# EAGLE schematic SWD (EAGLE 6.1)
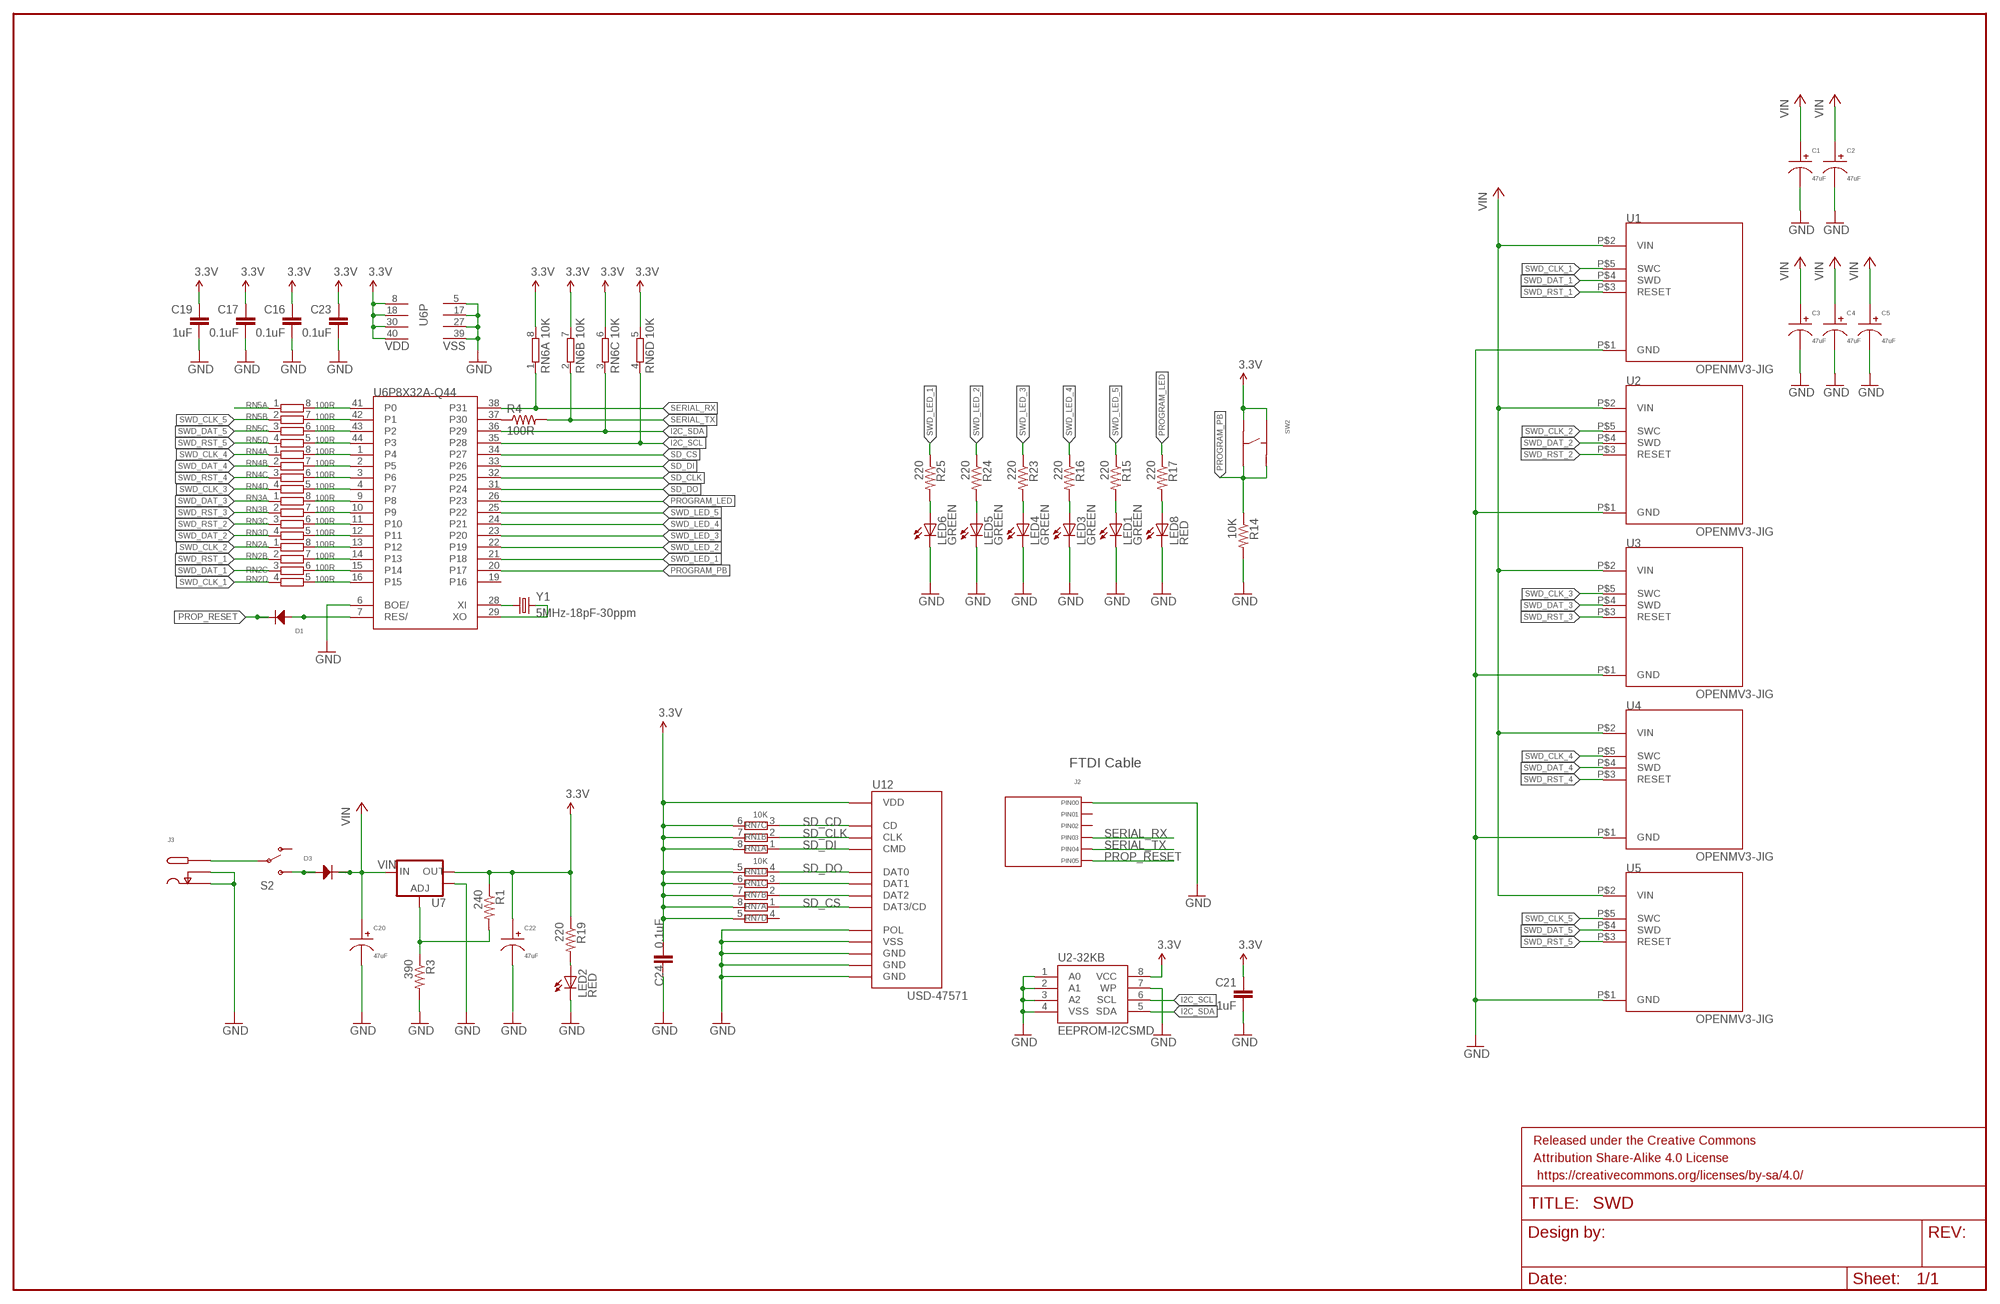
[diagram p0: schematic, sheet 1]

## Parts
C1  47uF  CAPACITOR_P_6.3MM  [CP6.3MM]
C2  47uF  CAPACITOR_P_6.3MM  [CP6.3MM]
C3  47uF  CAPACITOR_P_6.3MM  [CP6.3MM]
C4  47uF  CAPACITOR_P_6.3MM  [CP6.3MM]
C5  47uF  CAPACITOR_P_6.3MM  [CP6.3MM]
C16  0.1uF  CAP0603-CAP  [0603-CAP]
C17  0.1uF  CAP0603-CAP  [0603-CAP]
C19  1uF  CAP0603-CAP  [0603-CAP]
C20  47uF  CAPACITOR_P_6.3MM  [CP6.3MM]
C21  1uF  CAP0603-CAP  [0603-CAP]
C22  47uF  CAPACITOR_P_6.3MM  [CP6.3MM]
C23  0.1uF  CAP0603-CAP  [0603-CAP]
C24  0.1uF  CAP0603-CAP  [0603-CAP]
D1  DIODE_SOD-123  [SOD-123]
D3  DIODE_SMA  [SMA]
FRAME1  FRAME-LEDGER  [CREATIVE_COMMONS]
J2  HEADER_01X06_PTH_2.54MM  [PTH_2.54MM_01X06]
J3  DC_PWR_JACK_2.5MM_RIGHT  [DC_PWR_JACK]
LED1  GREEN  LED0603  [LED-0603]
LED2  RED  LED0603  [LED-0603]
LED3  GREEN  LED0603  [LED-0603]
LED4  GREEN  LED0603  [LED-0603]
LED5  GREEN  LED0603  [LED-0603]
LED6  GREEN  LED0603  [LED-0603]
LED8  RED  LED0603  [LED-0603]
R1  240  RESISTOR0603-RES  [0603-RES]
R3  390  RESISTOR0603-RES  [0603-RES]
R4  100R  RESISTOR0603-RES  [0603-RES]
R14  10K  RESISTOR0603-RES  [0603-RES]
R15  220  RESISTOR0603-RES  [0603-RES]
R16  220  RESISTOR0603-RES  [0603-RES]
R17  220  RESISTOR0603-RES  [0603-RES]
R19  220  RESISTOR0603-RES  [0603-RES]
R23  220  RESISTOR0603-RES  [0603-RES]
R24  220  RESISTOR0603-RES  [0603-RES]
R25  220  RESISTOR0603-RES  [0603-RES]
RN1  10K  4R-NEXBV8V  [EXBV8V]
RN2  100R  4R-NEXBV8V  [EXBV8V]
RN3  100R  4R-NEXBV8V  [EXBV8V]
RN4  100R  4R-NEXBV8V  [EXBV8V]
RN5  100R  4R-NEXBV8V  [EXBV8V]
RN6  10K  4R-NEXBV8V  [EXBV8V]
RN7  10K  4R-NEXBV8V  [EXBV8V]
S2  SWITCH-SPSTPTH  [SWITCH-SPDT]
SW2  TACT_6MM  [TACT6MM]
U1  OPENMV3-JIG  [OPENMV3-JIG]
U2  OPENMV3-JIG  [OPENMV3-JIG]
U2-32KB  EEPROM-I2CSMD  [SO08]
U3  OPENMV3-JIG  [OPENMV3-JIG]
U4  OPENMV3-JIG  [OPENMV3-JIG]
U5  OPENMV3-JIG  [OPENMV3-JIG]
U6  P8X32A-Q44  [P8X32A-Q44]
U7  V_REG_LM1117SOT223  [SOT223]
U12  USD-47571  [USD-47571]
Y1  5MHz-18pF-30ppm  CRYSTALSMD  [HC49UP]

## Nets
3.3V: C16.1 C17.1 C19.1 C21.1 C22.P$1 C23.1 C24.1 R1.1 R19.1 RN1.5 RN1.6 RN1.7 RN1.8 RN6.5 RN6.6 RN6.7 RN6.8 RN7.5 RN7.6 RN7.7 RN7.8 SW2.P$1 SW2.P$3 U2-32KB.8(VCC) U6.8(P:VDD) U6.18(P:VDD) U6.30(P:VDD) U6.40(P:VDD) U7.2(OUT) U12.P$4(VDD)
GND: C1.P$2 C2.P$2 C3.P$2 C4.P$2 C5.P$2 C16.2 C17.2 C19.2 C20.P$2 C21.2 C22.P$2 C23.2 C24.2 J2.P$1(PIN0) J3.SLEEVE1(SLEEVE) J3.SLEEVE2(SLEEVE_SHUNT) LED1.C LED2.C LED3.C LED4.C LED5.C LED6.C LED8.C R3.2 R14.2 U1.P$1(GND) U2-32KB.1(A0) U2-32KB.2(A1) U2-32KB.3(A2) U2-32KB.4(VSS) U2-32KB.7(WP) U2.P$1(GND) U3.P$1(GND) U4.P$1(GND) U5.P$1(GND) U6.5(P:VSS) U6.6(P8X32A-Q44:BOE/) U6.17(P:VSS) U6.27(P:VSS) U6.39(P:VSS) U7.4(OUT) U12.G$1(GND) U12.G$2(GND) U12.G$3(GND) U12.G$4(POL) U12.P$6(VSS)
I2C_SCL: RN6.4 U2-32KB.6(SCL) U6.35(P8X32A-Q44:P28)
I2C_SDA: RN6.3 U2-32KB.5(SDA) U6.36(P8X32A-Q44:P29)
N$1: R4.1 U6.37(P8X32A-Q44:P30)
N$2: D3.ANODE S2.3(S)
N$3: U6.28(P8X32A-Q44:XI) Y1.1
N$4: U6.29(P8X32A-Q44:XO) Y1.2
N$6: LED2.A R19.2
N$7: D1.ANODE U6.7(P8X32A-Q44:RES/)
N$9: J3.PIN S2.2(P)
N$12: RN1.3 U12.P$8(DAT1)
N$13: RN7.2 U12.P$1(DAT2)
N$14: LED6.A R25.2
N$15: LED5.A R24.2
N$16: LED4.A R23.2
N$18: LED3.A R16.2
N$19: LED1.A R15.2
N$20: LED8.A R17.2
N$21: RN5.1
N$22: RN2.8 U6.13(P8X32A-Q44:P12)
N$23: RN2.7 U6.14(P8X32A-Q44:P13)
N$24: RN2.6 U6.15(P8X32A-Q44:P14)
N$25: RN2.5 U6.16(P8X32A-Q44:P15)
N$26: RN3.5 U6.12(P8X32A-Q44:P11)
N$27: RN3.6 U6.11(P8X32A-Q44:P10)
N$28: RN3.7 U6.10(P8X32A-Q44:P9)
N$29: RN3.8 U6.9(P8X32A-Q44:P8)
N$31: R1.2 R3.1 U7.1(ADJ)
N$41: RN5.6 U6.43(P8X32A-Q44:P2)
N$42: RN5.7 U6.42(P8X32A-Q44:P1)
N$43: RN5.8 U6.41(P8X32A-Q44:P0)
N$46: RN5.5 U6.44(P8X32A-Q44:P3)
N$47: RN4.8 U6.1(P8X32A-Q44:P4)
N$48: RN4.7 U6.2(P8X32A-Q44:P5)
N$49: RN4.6 U6.3(P8X32A-Q44:P6)
N$50: RN4.5 U6.4(P8X32A-Q44:P7)
PROGRAM_LED: R17.1 U6.26(P8X32A-Q44:P23)
PROGRAM_PB: R14.1 SW2.P$2 SW2.P$4 U6.20(P8X32A-Q44:P17)
PROP_RESET: D1.CATHODE J2.P$6(PIN5)
SD_CD: RN7.3 U12.G$5(CD)
SD_CLK: RN1.2 U6.32(P8X32A-Q44:P25) U12.P$5(CLK)
SD_CS: RN7.1 U6.34(P8X32A-Q44:P27) U12.P$2(DAT3/CD)
SD_DI: RN1.1 U6.33(P8X32A-Q44:P26) U12.P$3(CMD)
SD_DO: RN1.4 U6.31(P8X32A-Q44:P24) U12.P$7(DAT0)
SERIAL_RX: J2.P$4(PIN3) RN6.1 U6.38(P8X32A-Q44:P31)
SERIAL_TX: J2.P$5(PIN4) R4.2 RN6.2
SWD_CLK_1: RN2.4 U1.P$5(SWC)
SWD_CLK_2: RN2.1 U2.P$5(SWC)
SWD_CLK_3: RN4.4 U3.P$5(SWC)
SWD_CLK_4: RN4.1 U4.P$5(SWC)
SWD_CLK_5: RN5.2 U5.P$5(SWC)
SWD_DAT_1: RN2.3 U1.P$4(SWD)
SWD_DAT_2: RN3.4 U2.P$4(SWD)
SWD_DAT_3: RN3.1 U3.P$4(SWD)
SWD_DAT_4: RN4.2 U4.P$4(SWD)
SWD_DAT_5: RN5.3 U5.P$4(SWD)
SWD_LED_1: R25.1 U6.21(P8X32A-Q44:P18)
SWD_LED_2: R24.1 U6.22(P8X32A-Q44:P19)
SWD_LED_3: R23.1 U6.23(P8X32A-Q44:P20)
SWD_LED_4: R16.1 U6.24(P8X32A-Q44:P21)
SWD_LED_5: R15.1 U6.25(P8X32A-Q44:P22)
SWD_RST_1: RN2.2 U1.P$3(RESET)
SWD_RST_2: RN3.3 U2.P$3(RESET)
SWD_RST_3: RN3.2 U3.P$3(RESET)
SWD_RST_4: RN4.3 U4.P$3(RESET)
SWD_RST_5: RN5.4 U5.P$3(RESET)
VIN: C1.P$1 C2.P$1 C3.P$1 C4.P$1 C5.P$1 C20.P$1 D3.CATHODE U1.P$2(VIN) U2.P$2(VIN) U3.P$2(VIN) U4.P$2(VIN) U5.P$2(VIN) U7.3(IN)
Unconnected: J2.P$2(PIN1) J2.P$3(PIN2) RN7.4 S2.1(O) U6.19(P8X32A-Q44:P16)

## Notes on the sheet
- FTDI Cable

## Library data of the parts
C1-C5 C20 C22 = MF_Passives:CAPACITOR_P: Library: MF_Passives Description: Device for Polarized Capacitors. Manufacture part number (MFG#), Voltage Rating, and Tolerance can be added via Attributes.; MFG#: N/A; TOLERANCE: N/A; VOTLAGE: N/A
C16 C17 C19 C21 C23 C24 = sfe:CAP: Capacitor Standard 0603 ceramic capacitor, and 0.1" leaded capacitor.
D1 D3 = MF_Discrete_Semiconductor:DIODE: Library: MF_Discrete_Semiconductor Description: Device for Single Packaged Diodes. Manufacture part number (MFG#) can be added via Attributes.; MFG#: N/A
FRAME1 = SparkFun-Aesthetics:FRAME-LEDGER: Schematic Frame Standard 11x14 US Ledger frame
J2 = MF_Connectors:HEADER_01X06: Library: MF_Connectors Description: Header Connector with 6 Positions and 01 Rows. Use the LABEL Attribute to label the pin on the schematic and PCB. You can remove the attributes on the PCB by using the SMASH function on the part and then deleting the text.
J3 = MF_Connectors:DC_PWR_JACK: Library: MF_Connectors Description: DC Barrel Power Jack Connector.
LED1-LED6 LED8 = sfe:LED: LEDs Standard schematic elements and footprints for 5mm, 3mm, 1206, and 0603 sized LEDs. 5mm - Spark Fun Electronics SKU : COM-00529 (and others)
R1 R3 R4 R14-R17 R19 R23-R25 = sfe:RESISTOR: Resistor Basic schematic elements and footprints for 0603, 1206, and PTH resistors.
RN1-RN7 = resistor-dil:4R-N: Array Chip Resistor Source: RS Component / Phycomp; OC_FARNELL: unknown; OC_NEWARK: unknown
S2 = sfe:SWITCH-SPST: SPST Switch Simple slide switch. Spark Fun Electronics SKU : COM-00102
SW2 = MF_Switches:TACT: Library: MF_Switches Description: Device for Tact Switches. Manufacture part number (MFG#) can be added via Attributes.; MFG#: N/A
U1-U5 = openmv:OPENMV3-JIG
U2-32KB = SparkFun-DigitalIC:EEPROM-I2C: I2C EEPROM chips, 24LC256 (and others)
U6 = SparkFun-DigitalIC:P8X32A-Q44: Propellor uC
U7 = sfe:V_REG_LM1117: Voltage Regulator LM1117 Standard adjustable voltage regulator but in SMD form. Spark Fun Electronics SKU : COM-00595
U12 = mux:USD-47571
Y1 = SparkFun-FreqCtrl:CRYSTAL: Various standard crystals. Proven footprints.